# Altium project SingleBoardDrone.PrjPcb (part 2 of 2)

## Sheet SingleBoardDrone_Sens.SchDoc
size B; SheetNumber: 4; SheetTotal: 5
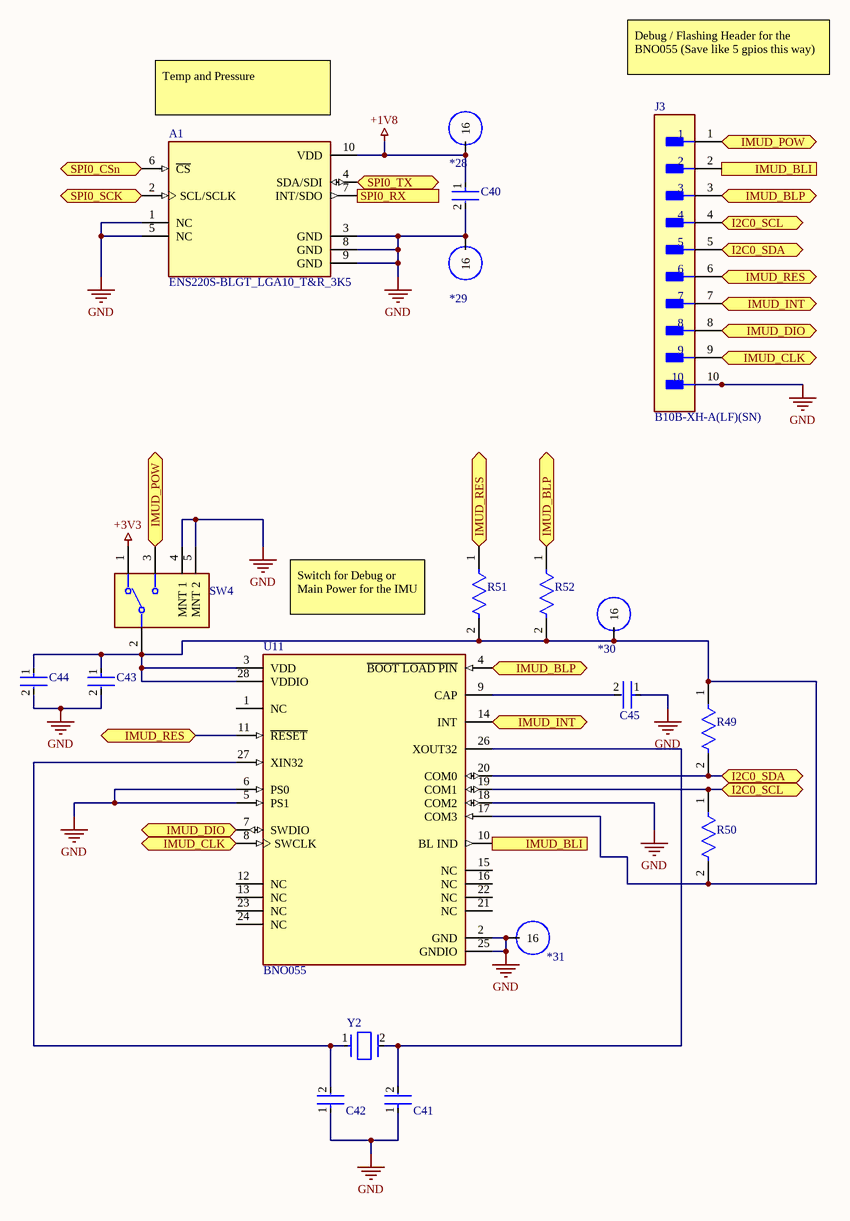
[diagram p3: SingleBoardDrone_Sens.SchDoc]

### Parts
*28  Component_1  [Test_Point]  (value not drawn)  (no BOM)
*29  Component_1  [Test_Point]  (value not drawn)  (no BOM)
*30  Component_1  [Test_Point]  (value not drawn)  (no BOM)
*31  Component_1  [Test_Point]  (value not drawn)  (no BOM)
A1  ENS220S-BLGT_LGA10_T&R_3K5  [XDCR_ENS220S-BLGT_LGA10_T&R_3K5]
C40  CL03A104KP3NNNC  [FP-CL03-IPC_C]  (value not drawn)
C41  C0805C220J5RACTU  [FP-C0805C-DN-MFG]  (value not drawn)
C42  C0805C220J5RACTU  [FP-C0805C-DN-MFG]  (value not drawn)
C43  CL03A104KP3NNNC  [FP-CL03-IPC_C]  (value not drawn)
C44  CL03A104KP3NNNC  [FP-CL03-IPC_C]  (value not drawn)
C45  CGA3E1X7R1E105K080AC  [FP-CGA3E-0_3-0_1-IPC_A]  (value not drawn)
J3  B10B-XH-A(LF)(SN)  [FP-B10B-XH-A_LF_SN-MFG]
R49  RMCF0603JG10K0  [FP-RMCF0603-MFG]  (value not drawn)
R50  RMCF0603JG10K0  [FP-RMCF0603-MFG]  (value not drawn)
R51  RMCF0603JG10K0  [FP-RMCF0603-MFG]  (value not drawn)
R52  RMCF0603JG10K0  [FP-RMCF0603-MFG]  (value not drawn)
SW4  1825232-1  [FP-1825232-1-MFG]  (value not drawn)
U11  BNO055  [FP-BNO055-MFG]
Y2  ABS07-32.768KHZ-T  [FP-ABS07-MFG]  (value not drawn)

### Ports
I2C0_SCL (bidir, see SingleBoardDrone_RP2350[3B], SingleBoardDrone_Sens[3A]), I2C0_SCL (bidir, see SingleBoardDrone_RP2350[3B], SingleBoardDrone_Sens[3C]), I2C0_SDA (bidir, see SingleBoardDrone_RP2350[3B], SingleBoardDrone_Sens[3A]), I2C0_SDA (bidir, see SingleBoardDrone_RP2350[3B], SingleBoardDrone_Sens[3C]), IMUD_BLI (out, see SingleBoardDrone_Sens[2C]), IMUD_BLI (out, see SingleBoardDrone_Sens[3A]), IMUD_BLP (bidir, see SingleBoardDrone_Sens[2B], SingleBoardDrone_Sens[2C]), IMUD_BLP (bidir, see SingleBoardDrone_Sens[2B], SingleBoardDrone_Sens[3A]), IMUD_BLP (bidir, see SingleBoardDrone_Sens[2C], SingleBoardDrone_Sens[3A]), IMUD_CLK (bidir, see SingleBoardDrone_Sens[1C]), IMUD_CLK (bidir, see SingleBoardDrone_Sens[3B]), IMUD_DIO (bidir, see SingleBoardDrone_Sens[1C]), IMUD_DIO (bidir, see SingleBoardDrone_Sens[3B]), IMUD_INT (bidir, see SingleBoardDrone_RP2350[1A], SingleBoardDrone_Sens[2C]), IMUD_INT (bidir, see SingleBoardDrone_RP2350[1A], SingleBoardDrone_Sens[3B]), IMUD_POW (bidir, see SingleBoardDrone_Sens[1B]), IMUD_POW (bidir, see SingleBoardDrone_Sens[3A]), IMUD_RES (bidir, see SingleBoardDrone_Sens[1C], SingleBoardDrone_Sens[2B]), IMUD_RES (bidir, see SingleBoardDrone_Sens[1C], SingleBoardDrone_Sens[3B]), IMUD_RES (bidir, see SingleBoardDrone_Sens[2B], SingleBoardDrone_Sens[3B]), SPI0_CSn (bidir, see SingleBoardDrone_RP2350[1A]), SPI0_RX (out, see SingleBoardDrone_RP2350[1A]), SPI0_SCK (bidir, see SingleBoardDrone_RP2350[1A]), SPI0_TX (bidir, see SingleBoardDrone_RP2350[1A])

### Nets
+1V8: *28.TP1(16) A1.10(VDD) C40.1
+3V3: SW4.1
GND: *29.TP1(16) *31.TP1(16) A1.1(NC) A1.3(GND) A1.5(NC) A1.8(GND) A1.9(GND) C40.2 C41.1 C42.1 C43.2 C44.2 C45.1 J3.10 SW4.4(MNT_1) SW4.5(MNT_2) U11.2(GND) U11.5(PS1) U11.6(PS0) U11.18(COM2) U11.25(GNDIO)
Net*30_TP1: *30.TP1(16) C43.1 C44.1 R49.1 R50.2 R51.2 R52.2 SW4.2 U11.3(VDD) U11.17(COM3) U11.28(VDDIO)
NetA1_2: A1.2(SCL/SCLK) ; port SPI0_SCK
NetA1_4: A1.4(SDA/SDI) ; port SPI0_TX
NetA1_6: A1.6(~{CS}) ; port SPI0_CSn
NetA1_7: A1.7(INT/SDO) ; port SPI0_RX
NetC41_2: C41.2 U11.26(XOUT32) Y2.2
NetC42_2: C42.2 U11.27(XIN32) Y2.1
NetC45_2: C45.2 U11.9(CAP)
NetJ3_1: J3.1 SW4.3 ; port IMUD_POW
NetJ3_2: J3.2 U11.10(BL_IND) ; port IMUD_BLI
NetJ3_3: J3.3 R52.1 U11.4(~{BOOT_LOAD_PIN}) ; port IMUD_BLP
NetJ3_4: J3.4 R50.1 U11.19(COM1) ; port I2C0_SCL
NetJ3_5: J3.5 R49.2 U11.20(COM0) ; port I2C0_SDA
NetJ3_6: J3.6 R51.1 U11.11(~{RESET}) ; port IMUD_RES
NetJ3_7: J3.7 U11.14(INT) ; port IMUD_INT
NetJ3_8: J3.8 U11.7(SWDIO) ; port IMUD_DIO
NetJ3_9: J3.9 U11.8(SWCLK) ; port IMUD_CLK

Not connected (* = marked no-connect by the designer): U11 1(NC) 12(NC) 13(NC) 15(NC) 16(NC) 21(NC) 22(NC) 23(NC) 24(NC)

### Notes on the sheet
- (near A1) Temp and Pressure
- Debug / Flashing Header for the BNO055 (Save like 5 gpios this way)
- Switch for Debug or Main Power for the IMU

### Library data of the parts
A1 = ENS220S-BLGT_LGA10_T&R_3K5: Premium accuracy barometric pressure and temperature sensor for activity tracking and indoor navigation/localization; MF: ScioSense; MP: ENS220S-BLGT LGA10 T&amp;R 3K5; SnapEDA_Link: https://www.snapeda.com/parts/ENS220S-BLGT%20LGA10%20T&R%203K5/ScioSense/view-part/?ref=snap; Package: None; Value: *; Check_prices: https://www.snapeda.com/parts/ENS220S-BLGT%20LGA10%20T&R%203K5/ScioSense/view-part/?ref=eda
C40 C43 C44 = CMP-2010-00672-2: as C3 on sheet SingleBoardDrone_RP2350; Radiation Hardening: No; Voltage Rating: 10V; Dielectric: X5R; Length: 0.6mm; Voltage Rating (DC): 10V; Package Quantity: 1; Height: 0.3mm; Width: 0.012inch; Min Operating Temperature: -55°C; Lead Free: Lead Free; Tolerance: 10%; Contact Plating: Tin; Depth: 0.3mm; Max Operating Temperature: 85°C; Case/Package: 0201; Capacitance: 100nF; Mount: Surface Mount; Thickness: 0.013inch; Case Code (Metric): 0603; Case Code (Imperial): 0201; Packaging: Tape and Reel
C41 C42 = CMP-03020-030005-1: C0805 22 pF X7R 30ppm/°C 5.00% 50 V; Manufacturer: KEMET; Voltage Rating: 50 V; Value: 22 pF; Material: Ceramic; Tolerance: 0.05; RoHS: TRUE; Temperature Range Low: -55°C; Temperature: -55°C to +125°C; Device Class L3: Ceramic Capacitors; Temperature Coefficient: 30ppm/°C; Temperature Range High: +125°C; Octopart: https://octopart.com/c0805c220j5ractu-kemet-76790706; Automotive: No; Manufacturer Part Number: C0805C220J5RACTU; ComponentLink2Description: Datasheet; Ipc Land Pattern Name: CAPC200125X78; Temperature Characteristic: X7R; Category: Cap; Package: C0805C-DN; Lead Free: Yes; Capacitance: 22 pF; Device Class L2: Capacitors; ComponentLink2URL: https://content.kemet.com/datasheets/KEM_C1003_C0G_SMD.pdf; Height: 0.88mm; Device Class L1: Passive Components
C45 = CMP-08246-001507-1: as C37 on sheet SingleBoardDrone_Pow; Dielectric: X7R; Capacitance: 1uF; Voltage Rating: 25V; Thickness: 0.035inch; Width: 0.031inch; Ratings: AEC-Q200; Case Code (Metric): 1608; REACH SVHC: No SVHC; Voltage: 25V; Composition: Ceramic; Min Operating Temperature: -55°C; Termination: SMD/SMT; Depth: 0.8mm; Max Operating Temperature: 125°C; Mount: Surface Mount; Weight: 7.1E-05oz; Package Quantity: 4000; Tolerance: 10%; Packaging: Tape and Reel; Lead Free: Lead Free; Case/Package: 0603; Length: 1.6mm; Height: 0.8mm; Case Code (Imperial): 0603; Voltage Rating (DC): 25V
J3 = CMP-17439-000145-1: CONN HEADER VERT 10POS 2.5MM; Voltage Rating: 250V; Current Rating: 3A; Wire/Cable Gauge: 22AWG; Number of Contacts: 10; Contact Resistance: 20mR; Mated Stacking Heights: 9.8mm; Gender: Male; Insulation Resistance: 1GR; Series: XH; Max Current Rating: 3A; Contact Shape: Square; Contact Material: Brass; Housing Material: Polyamide; Lead Free: Lead Free; Orientation: Straight; Max Voltage Rating (DC): 250V; Contact Type: Male Pin; Number of Positions: 10; Length: 27.4mm; Housing Color: White; Max Voltage Rating (AC): 250V; Depth: 5.75mm; Mount: Through Hole; Pitch: 2.5mm; Fastening Type: Detent; Flammability Rating: UL94 V-0; Color: Natural; Contact Plating: Tin; Insulation Color: Natural; Packaging: Bulk; REACH SVHC: No SVHC; Insulation Material: Nylon; Connector Type: Header; Lead Pitch: 2.5mm; Contact Finish - Mating: TIN; Voltage Rating (AC): 250V; Number of Rows: 1; Max Operating Temperature: 85°C; Min Operating Temperature: -25°C; Termination: Solder
R49-R52 = CMP-26527-000153-1: as R90 on sheet SingleBoardDrone_Pow; Tolerance: 5%; Case Code (Imperial): 0603; Series: RMCF; Resistor Type: Thick Film; Length: 0.061inch; Features: Automotive AEC-Q200; Height: 0.022inch; Case Code (Metric): 1608; Width: 0.031inch; Number of Terminations: 2; Contact Plating: Tin; Case/Package: 0603; Package Quantity: 1; Max Operating Temperature: 155°C; Mount: Surface Mount; RoHS Compliant: Yes; Radiation Hardening: No; Min Operating Temperature: -55°C; Packaging: Tape and Reel
SW4 = CMP-03405-000001-1: SWITCH SLIDE SPDT 200MA 30V; Manufacturer: TE Connectivity; Contact Current Rating: 0.2A; Contact Resistance: 20mΩ; Electromechanical Life: 10000Cycles; Operating Force: 200gf; Throw Configuration: SPDT; Manufacturer Part Number: 1825232-1; Temperature Range High: +70°C; Height: 3.7mm; ComponentLink2URL: https://www.te.com/commerce/DocumentDelivery/DDEController?Action=showdoc&DocId=Customer+Drawing%7F1825232%7FB2%7Fpdf%7FEnglish%7FENG_CD_1825232_B2.pdf%7F1825232-1; Mount: Through Hole; Mouser Description: Slide Switches SLIDE SWITCH SPDT Right Angle; Package: 1825232-1; Temperature: -20°C to +70°C; Automotive: No; ComponentLink2Description: Datasheet; Lead Free: Yes; Octopart: https://octopart.com/1825232-1-te+connectivity-45209882; Device Class L1: Electromechanical; Digikey Description: SWITCH SLIDE SPDT 200MA 30V; Device Class L3: Slide Switches; Device Class L2: Switches; Voltage Rating Dc: 30V; Temperature Range Low: -20°C; Category: Switch; RoHS: TRUE
U11 = CMP-2000-05075-4: IMU ACCEL/GYRO/MAG I2C 28LGA; Sensor Type: Accelerometer; Packaging: Tape and Reel; Case/Package: LGA; Min Operating Temperature: -40°C; Mount: Surface Mount; Output Type: I2C; Lead Free: Lead Free; Max Operating Temperature: 85°C
Y2 = CMP-0447-00001-4: Crystal 32.768kHz ±20ppm (Tol) 12.5pF FUND 70kΩ 2-Pin CSMD T/R; ESR (Equivalent Series Resistance): 70kR; Radiation Hardening: No; Frequency: 32.768kHz; Length: 3.2mm; Max Operating Temperature: 85°C; Number of Pins: 2; Series: ABS07; Min Operating Temperature: -40°C; Frequency Tolerance: 20ppm; Packaging: Tape and Reel; Height: 0.9mm; Width: 1.5mm; Depth: 1.5mm; Load Capacitance: 12.5pF; RoHS Compliant: Yes; Tolerance: 20ppm; Termination: SMD/SMT; Lead Free: Lead Free; Series Resistance: 70kR; REACH SVHC: No SVHC; Case/Package: CSMD; Operating Frequency: 32.768 kHz; Package Quantity: 3000

## Sheet SingleBoardDrone_RF.SchDoc
size B; SheetNumber: 5; SheetTotal: 5
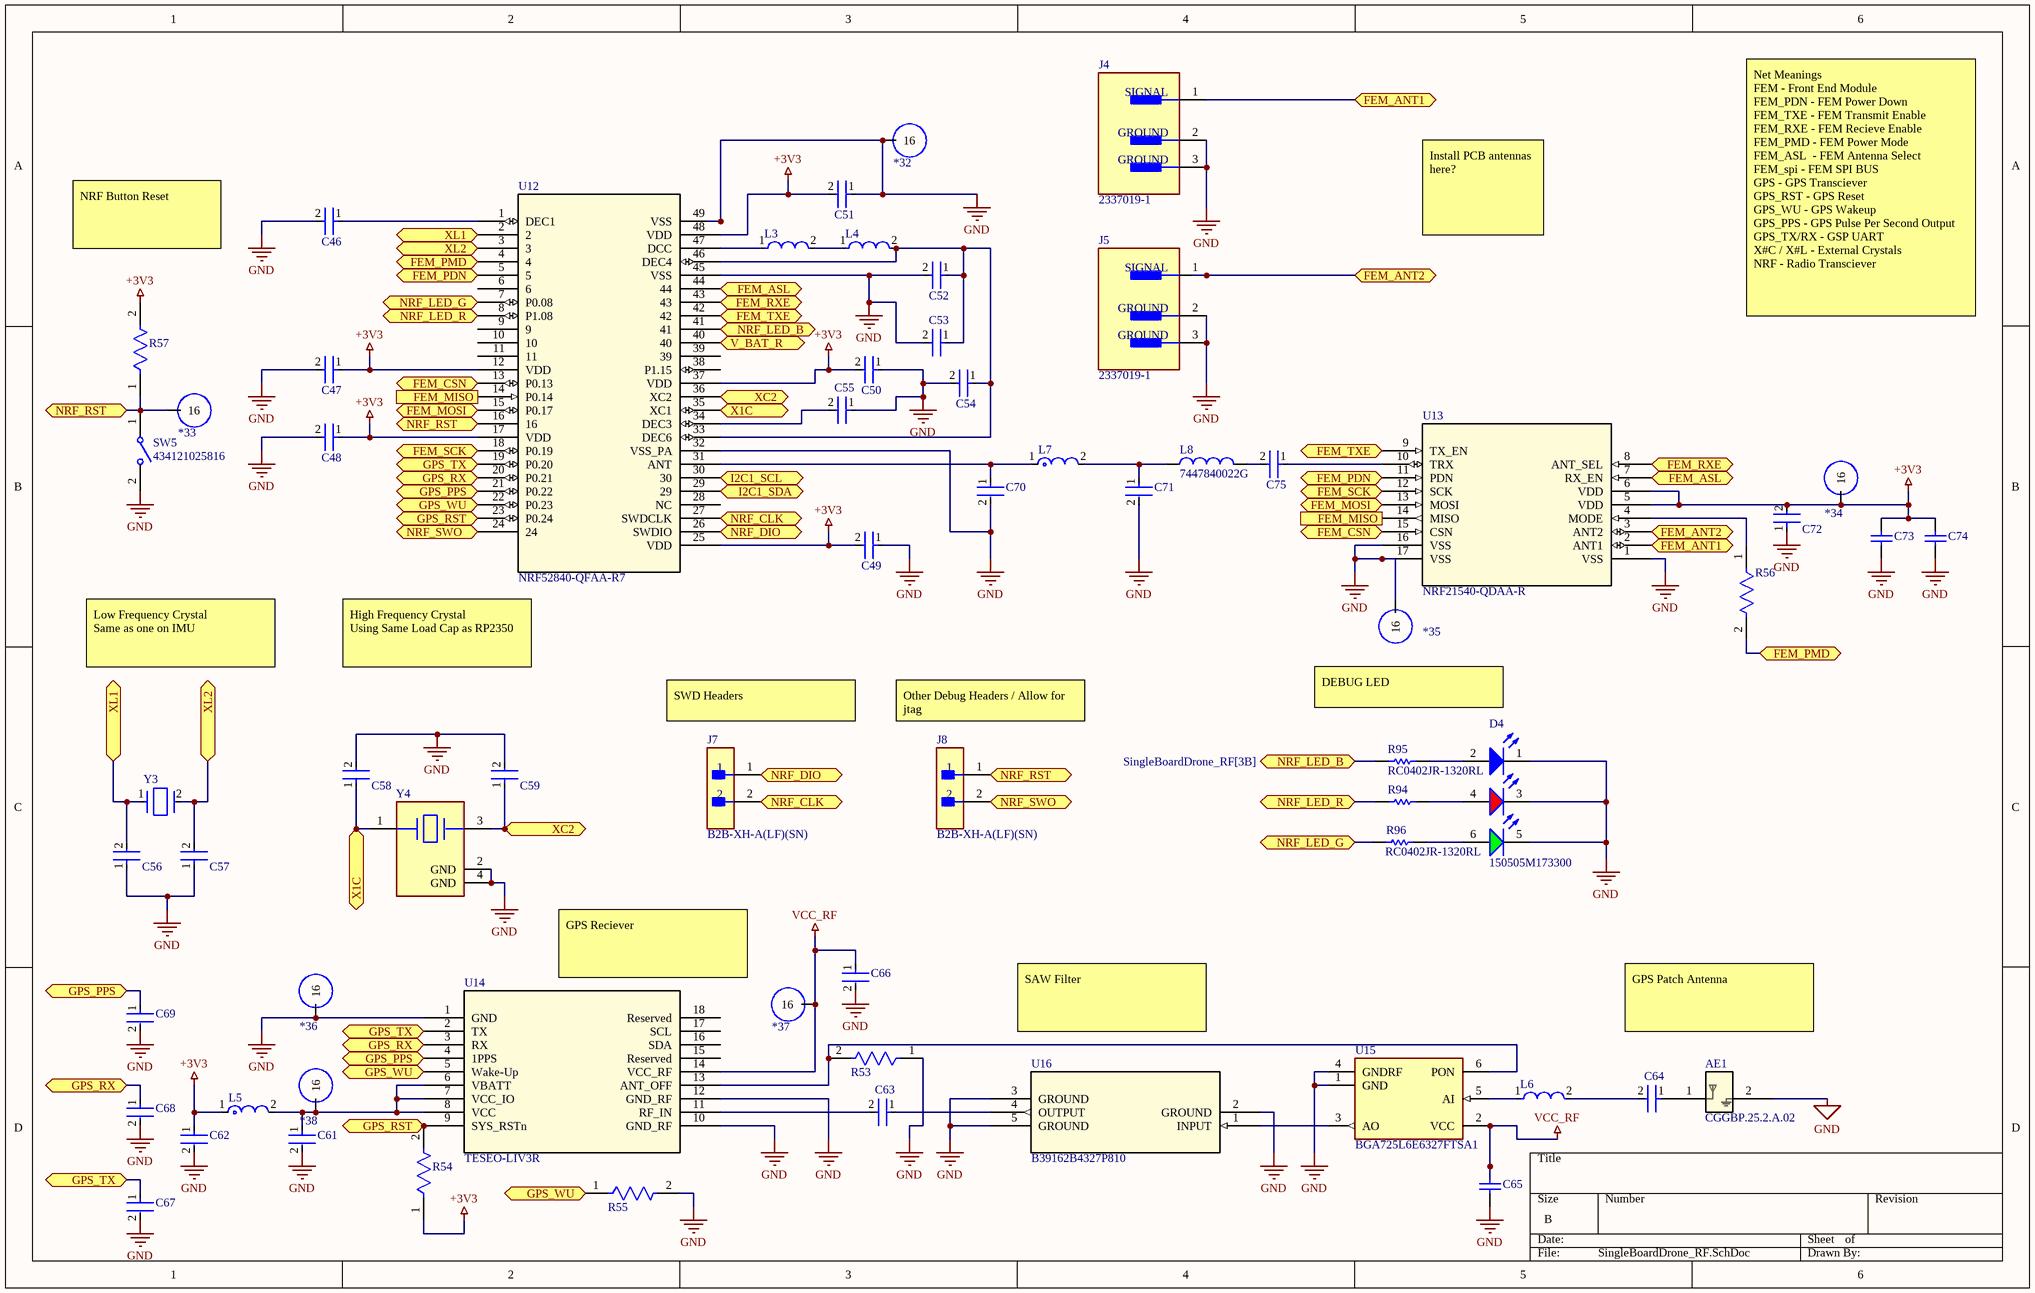
[diagram p4: SingleBoardDrone_RF.SchDoc]

### Parts
*32  Component_1  [Test_Point]  (value not drawn)  (no BOM)
*33  Component_1  [Test_Point]  (value not drawn)  (no BOM)
*34  Component_1  [Test_Point]  (value not drawn)  (no BOM)
*35  Component_1  [Test_Point]  (value not drawn)  (no BOM)
*36  Component_1  [Test_Point]  (value not drawn)  (no BOM)
*37  Component_1  [Test_Point]  (value not drawn)  (no BOM)
*38  Component_1  [Test_Point]  (value not drawn)  (no BOM)
AE1  CGGBP.25.2.A.02  [ANT_CGGBP.25.2.A.02_TAL]
C46  CL03A104KP3NNNC  [FP-CL03-IPC_C]  (value not drawn)
C47  CL03A104KP3NNNC  [FP-CL03-IPC_C]  (value not drawn)
C48  CL03A104KP3NNNC  [FP-CL03-IPC_C]  (value not drawn)
C49  CL03A104KP3NNNC  [FP-CL03-IPC_C]  (value not drawn)
C50  CL03A104KP3NNNC  [FP-CL03-IPC_C]  (value not drawn)
C51  CGA3E1X7R1E105K080AC  [FP-CGA3E-0_3-0_1-IPC_A]  (value not drawn)
C52  CGA3E1X7R1E105K080AC  [FP-CGA3E-0_3-0_1-IPC_A]  (value not drawn)
C53  EMK105B7473KV-F  [FP-0402-L_1_0_0_05-W_0_5-MFG]  (value not drawn)
C54  CL03A104KP3NNNC  [FP-CL03-IPC_C]  (value not drawn)
C55  GRM033R61E101KA01D  [FP-GRM033-0_03-IPC_C]  (value not drawn)
C56  C0805C220J5RACTU  [FP-C0805C-DN-MFG]  (value not drawn)
C57  C0805C220J5RACTU  [FP-C0805C-DN-MFG]  (value not drawn)
C58  CC0402JRNPO9BN150  [FP-CC0402-0_55-IPC_B]  (value not drawn)
C59  CC0402JRNPO9BN150  [FP-CC0402-0_55-IPC_B]  (value not drawn)
C61  GRM0335C1H560JA01D  [FP-GRM033-0_03-IPC_B]  (value not drawn)
C62  GRM033R61E103KA12D  [FP-GRM033-0_03-IPC_C]  (value not drawn)
C63  GCM1555C1H121JA16D  [FP-GCM155-0_05-IPC_A]  (value not drawn)
C64  GCM1555C1H121JA16D  [FP-GCM155-0_05-IPC_A]  (value not drawn)
C65  GCM155R71H102KA37D  [CAPC1005X55X25LL05T10]  (value not drawn)
C66  GRM0335C1H560JA01D  [FP-GRM033-0_03-IPC_B]  (value not drawn)
C67  GRM0335C1H560JA01D  [FP-GRM033-0_03-IPC_B]  (value not drawn)
C68  GRM0335C1H560JA01D  [FP-GRM033-0_03-IPC_B]  (value not drawn)
C69  GRM0335C1H560JA01D  [FP-GRM033-0_03-IPC_B]  (value not drawn)
C70  GJM1555C1H1R0WB01D  [FP-GJM155-0_05-IPC_B]  (value not drawn)
C71  GJM0335C1E1R2BB01D  [FP-GJM033-0_03-MFG]  (value not drawn)
C72  CL03A104KP3NNNC  [FP-CL03-IPC_C]  (value not drawn)
C73  CL10A475KQ8NNNC  [CAPC1608X90X30LL10T20]  (value not drawn)
C74  CL10A475KQ8NNNC  [CAPC1608X90X30LL10T20]  (value not drawn)
C75  GJM1555C1H1R0WB01D  [FP-GJM155-0_05-IPC_B]  (value not drawn)
D4  150505M173300  [WL-SFTW_5050_150505M173300]
J4  2337019-1  [FP-2337019-1-MFG]
J5  2337019-1  [FP-2337019-1-MFG]
J7  B2B-XH-A(LF)(SN)  [FP-B2B-XH-A_LF_SN-MFG]
J8  B2B-XH-A(LF)(SN)  [FP-B2B-XH-A_LF_SN-MFG]
L3  LB2012T100K  [FP-LB2012-1_25-0_2-MFG]  (value not drawn)
L4  CB2518T150K  [FP-CB2518-IPC_B]  (value not drawn)
L5  LQG15HS27NJ02D  [FP-LQG15HH_02-IPC_C]  (value not drawn)
L6  LQW15AN5N6G80D  [FP-LQW15AN_80-MFG]  (value not drawn)
L7  LQG15HS4N7S02D  [FP-LQG15HH_02-IPC_A]  (value not drawn)
L8  7447840022G  [WE-MK_0402_L1W0.5H0.5]
R53  RMCF0603JG10K0  [FP-RMCF0603-MFG]  (value not drawn)
R54  RMCF0603JG10K0  [FP-RMCF0603-MFG]  (value not drawn)
R55  RMCF0603JG10K0  [FP-RMCF0603-MFG]  (value not drawn)
R56  AF0402FR-0733KL  [FP-AF0402-IPC_A]  (value not drawn)
R57  RMCF0603JG10K0  [FP-RMCF0603-MFG]  (value not drawn)
R94  ERJ-3EKF1400V  [RESC1608X55X30NL15T15]  (value not drawn)
R95  RC0402JR-1320RL  [RESC1005X40X25NL05T10]
R96  RC0402JR-1320RL  [RESC1005X40X25NL05T10]
SW5  434121025816  [434121025816]
U12  NRF52840-QFAA-R7  [QFN48_NRF52840-QFAA-R7_NOR]
U13  NRF21540-QDAA-R  [QFN16_4X4_NOR]
U14  TESEO-LIV3R  [ARRAY_LIV3R_STM]
U15  BGA725L6E6327FTSA1  [FP-PG-TSLP-6-MFG]
U16  B39162B4327P810  [B39162B4327P810_TDK]
Y3  ABS07-32.768KHZ-T  [FP-ABS07-MFG]  (value not drawn)
Y4  ABM8-32.000MHZ-10-D1G-T  [FP-ABM8-MFG]  (value not drawn)

### Ports
FEM_ANT1 (bidir, see SingleBoardDrone_RF[5A]), FEM_ANT1 (bidir, see SingleBoardDrone_RF[5B]), FEM_ANT2 (bidir, see SingleBoardDrone_RF[5A]), FEM_ANT2 (bidir, see SingleBoardDrone_RF[5B]), FEM_ASL (bidir, see SingleBoardDrone_RF[3A]), FEM_ASL (bidir, see SingleBoardDrone_RF[5B]), FEM_CSN (bidir, see SingleBoardDrone_RF[2B]), FEM_CSN (bidir, see SingleBoardDrone_RF[4B]), FEM_MISO (out, see SingleBoardDrone_RF[2B]), FEM_MISO (out, see SingleBoardDrone_RF[4B]), FEM_MOSI (bidir, see SingleBoardDrone_RF[2B]), FEM_MOSI (bidir, see SingleBoardDrone_RF[4B]), FEM_PDN (bidir, see SingleBoardDrone_RF[2A]), FEM_PDN (bidir, see SingleBoardDrone_RF[4B]), FEM_PMD (bidir, see SingleBoardDrone_RF[2A]), FEM_PMD (bidir, see SingleBoardDrone_RF[6C]), FEM_RXE (bidir, see SingleBoardDrone_RF[3A]), FEM_RXE (bidir, see SingleBoardDrone_RF[5B]), FEM_SCK (bidir, see SingleBoardDrone_RF[2B]), FEM_SCK (bidir, see SingleBoardDrone_RF[4B]), FEM_TXE (bidir, see SingleBoardDrone_RF[3A]), FEM_TXE (bidir, see SingleBoardDrone_RF[4B]), GPS_PPS (bidir, see SingleBoardDrone_RF[1D], SingleBoardDrone_RF[2B]), GPS_PPS (bidir, see SingleBoardDrone_RF[1D], SingleBoardDrone_RF[2D]), GPS_PPS (bidir, see SingleBoardDrone_RF[2B], SingleBoardDrone_RF[2D]), GPS_RST (bidir, see SingleBoardDrone_RF[2B]), GPS_RST (bidir, see SingleBoardDrone_RF[2D]), GPS_RX (bidir, see SingleBoardDrone_RF[1D], SingleBoardDrone_RF[2B]), GPS_RX (bidir, see SingleBoardDrone_RF[1D], SingleBoardDrone_RF[2D]), GPS_RX (bidir, see SingleBoardDrone_RF[2B], SingleBoardDrone_RF[2D]), GPS_TX (bidir, see SingleBoardDrone_RF[1D], SingleBoardDrone_RF[2B]), GPS_TX (bidir, see SingleBoardDrone_RF[1D], SingleBoardDrone_RF[2D]), GPS_TX (bidir, see SingleBoardDrone_RF[2B], SingleBoardDrone_RF[2D]), GPS_WU (bidir, see SingleBoardDrone_RF[2B], SingleBoardDrone_RF[2D]), GPS_WU (bidir, see SingleBoardDrone_RF[2D]), I2C1_SCL (bidir, see SingleBoardDrone_RP2350[1B]), I2C1_SDA (bidir, see SingleBoardDrone_RP2350[1B]), NRF_CLK (bidir, see SingleBoardDrone_RF[3B]), NRF_CLK (bidir, see SingleBoardDrone_RF[3C]), NRF_DIO (bidir, see SingleBoardDrone_RF[3B]), NRF_DIO (bidir, see SingleBoardDrone_RF[3C]), NRF_LED_B (bidir, see SingleBoardDrone_RF[3B]), NRF_LED_B (bidir, see SingleBoardDrone_RF[4C]), NRF_LED_G (bidir, see SingleBoardDrone_RF[2A]), NRF_LED_G (bidir, see SingleBoardDrone_RF[4C]), NRF_LED_R (bidir, see SingleBoardDrone_RF[2A]), NRF_LED_R (bidir, see SingleBoardDrone_RF[4C]), NRF_RST (bidir, see SingleBoardDrone_RF[1B], SingleBoardDrone_RF[2B]), NRF_RST (bidir, see SingleBoardDrone_RF[1B], SingleBoardDrone_RF[3C]), NRF_RST (bidir, see SingleBoardDrone_RF[2B], SingleBoardDrone_RF[3C]), NRF_SWO (bidir, see SingleBoardDrone_RF[2B]), NRF_SWO (bidir, see SingleBoardDrone_RF[3C]), V_BAT_R (bidir, see SingleBoardDrone_Pow[2A]), X1C (bidir, see SingleBoardDrone_RF[2C]), X1C (bidir, see SingleBoardDrone_RF[3B]), XC2 (bidir, see SingleBoardDrone_RF[2C]), XC2 (bidir, see SingleBoardDrone_RF[3B]), XL1 (bidir, see SingleBoardDrone_RF[1C]), XL1 (bidir, see SingleBoardDrone_RF[2A]), XL2 (bidir, see SingleBoardDrone_RF[1C]), XL2 (bidir, see SingleBoardDrone_RF[2A])

### Nets
+3V3: *34.TP1(16) C47.1 C48.1 C49.2 C50.2 C51.2 C62.1 C72.2 C73.1 C74.1 L5.1 R54.1 R57.2 U12.12(VDD) U12.17(VDD) U12.25(VDD) U12.37(VDD) U12.48(VDD) U13.5(VDD) U13.6(VDD)
GND: *32.TP1(16) *35.TP1(16) *36.TP1(16) AE1.2 C46.2 C47.2 C48.2 C49.1 C50.1 C51.1 C52.2 C53.2 C54.2 C55.1 C56.1 C57.1 C58.2 C59.2 C61.2 C62.2 C65.2 C66.2 C67.2 C68.2 C69.2 C70.2 C71.2 C72.1 C73.2 C74.2 D4.1(K) D4.3(K) D4.5(K) J4.2(GROUND) J4.3(GROUND) J5.2(GROUND) J5.3(GROUND) R53.1 R55.2 SW5.2 U12.32(VSS_PA) U12.45(VSS) U12.49(VSS) U13.1(VSS) U13.16(VSS) U13.17(VSS) U14.1(GND) U14.10(GND_RF) U14.12(GND_RF) U15.1(GND) U15.4(GNDRF) U16.2(GROUND) U16.3(GROUND) U16.5(GROUND) Y4.2(GND) Y4.4(GND)
VCC_RF: *37.TP1(16) C65.1 C66.1 U14.14(VCC_RF) U15.2(VCC)
Net*33_TP1: *33.TP1(16) J8.1 R57.1 SW5.1 U12.16 ; port NRF_RST
Net*38_TP1: *38.TP1(16) C61.1 L5.2 U14.6(VBATT) U14.7(VCC_IO) U14.8(VCC)
NetAE1_1: AE1.1 C64.1
NetC46_1: C46.1 U12.1(DEC1)
NetC52_1: C52.1 C53.1 C54.1 L4.2 U12.33(DEC6) U12.46(DEC4)
NetC55_2: C55.2 U12.34(DEC3)
NetC56_2: C56.2 U12.2 Y3.1 ; port XL1
NetC57_2: C57.2 U12.3 Y3.2 ; port XL2
NetC58_1: C58.1 U12.35(XC1) Y4.1 ; port X1C
NetC59_1: C59.1 U12.36(XC2) Y4.3 ; port XC2
NetC63_1: C63.1 U16.4(OUTPUT)
NetC63_2: C63.2 U14.11(RF_IN)
NetC64_2: C64.2 L6.2
NetC67_1: C67.1 U12.19(P0.20) U14.2(TX) ; port GPS_TX
NetC68_1: C68.1 U12.20(P0.21) U14.3(RX) ; port GPS_RX
NetC69_1: C69.1 U12.21(P0.22) U14.4(1PPS) ; port GPS_PPS
NetC70_1: C70.1 L7.1 U12.31(ANT)
NetC71_1: C71.1 L7.2 L8.1
NetC75_1: C75.1 U13.10(TRX)
NetC75_2: C75.2 L8.2
NetD4_2: D4.2(A) R95.2
NetD4_4: D4.4(A) R94.2
NetD4_6: D4.6(A) R96.2
NetJ4_1: J4.1(SIGNAL) U13.2(ANT1) ; port FEM_ANT1
NetJ5_1: J5.1(SIGNAL) U13.3(ANT2) ; port FEM_ANT2
NetJ7_1: J7.1 U12.26(SWDIO) ; port NRF_DIO
NetJ7_2: J7.2 U12.27(SWDCLK) ; port NRF_CLK
NetJ8_2: J8.2 U12.24 ; port NRF_SWO
NetL3_1: L3.1 U12.47(DCC)
NetL3_2: L3.2 L4.1
NetL6_1: L6.1 U15.5(AI)
NetR53_2: R53.2 U14.13(ANT_OFF) U15.6(PON)
NetR54_2: R54.2 U12.23(P0.24) U14.9(SYS_RSTn) ; port GPS_RST
NetR55_1: R55.1 U12.22(P0.23) U14.5(Wake-Up) ; port GPS_WU
NetR56_1: R56.1 U13.4(MODE)
NetR56_2: R56.2 U12.4 ; port FEM_PMD
NetR94_1: R94.1 U12.8(P1.08) ; port NRF_LED_R
NetR95_1: R95.1 U12.41 ; port NRF_LED_B
NetR96_1: R96.1 U12.7(P0.08) ; port NRF_LED_G
NetR98_1: U12.40 ; port V_BAT_R
NetU1_14: U12.29 ; port I2C1_SDA
NetU1_15: U12.30 ; port I2C1_SCL
NetU12_5: U12.5 U13.11(PDN) ; port FEM_PDN
NetU12_13: U12.13(P0.13) U13.15(CSN) ; port FEM_CSN
NetU12_14: U12.14(P0.14) U13.14(MISO) ; port FEM_MISO
NetU12_15: U12.15(P0.17) U13.13(MOSI) ; port FEM_MOSI
NetU12_18: U12.18(P0.19) U13.12(SCK) ; port FEM_SCK
NetU12_42: U12.42 U13.9(TX_EN) ; port FEM_TXE
NetU12_43: U12.43 U13.8(ANT_SEL) ; port FEM_RXE
NetU12_44: U12.44 U13.7(RX_EN) ; port FEM_ASL
NetU15_3: U15.3(AO) U16.1(INPUT)

Not connected (* = marked no-connect by the designer): U12 6 9 10 11 28(NC) 38(P1.15) 39; U14 15(Reserved) 16(SDA) 17(SCL) 18(Reserved)

### Notes on the sheet
- Install PCB antennas here?
- NRF Button Reset
- Net Meanings
  FEM - Front End Module
  FEM_PDN - FEM Power Down
  FEM_TXE - FEM Transmit Enable
  FEM_RXE - FEM Recieve Enable
  FEM_PMD - FEM Power Mode
  FEM_ASL  - FEM Antenna Select
  FEM_spi - FEM SPI BUS
  GPS - GPS Transciever
  GPS_RST - GPS Reset
  GPS_WU - GPS Wakeup
  GPS_PPS - GPS Pulse Per Second Output
  GPS_TX/RX - GSP UART
  X#C / X#L - External Crystals
  NRF - Radio Transciever
- Low Frequency Crystal
  Same as one on IMU
- High Frequency Crystal
  Using Same Load Cap as RP2350
- DEBUG LED
- SWD Headers
- Other Debug Headers / Allow for jtag
- GPS Reciever
- SAW Filter
- (near U15) GPS LNA
- GPS Patch Antenna

### Library data of the parts
AE1 = CGGBP.25.2.A.02: No Description Available; Manufacturer_Name: Taoglas Limited; Type: RF; Copyright: Copyright (C) 2025 Ultra Librarian. All rights reserved.; Manufacturer_Part_Number: CGGBP.25.2.A.02; RefDes: RefDes
C46-C50 C54 C72 = CMP-2010-00672-2: Cap Ceramic 100nF 10V X5R ±10% Pad SMD 0201 +85°C T/R; Radiation Hardening: No; Voltage Rating: 10V; Dielectric: X5R; Length: 0.6mm; Voltage Rating (DC): 10V; Package Quantity: 1; Height: 0.3mm; Width: 0.012inch; Min Operating Temperature: -55°C; Lead Free: Lead Free; Tolerance: 10%; Contact Plating: Tin; Depth: 0.3mm; Max Operating Temperature: 85°C; Case/Package: 0201; Capacitance: 100nF; Mount: Surface Mount; Thickness: 0.013inch; Case Code (Metric): 0603; Case Code (Imperial): 0201; Packaging: Tape and Reel
C51 C52 = CMP-08246-001507-1: Cap Ceramic 1uF 25V X7R 10% Pad SMD 0603 +125°C Automotive T/R; Dielectric: X7R; Capacitance: 1uF; Voltage Rating: 25V; Thickness: 0.035inch; Width: 0.031inch; Ratings: AEC-Q200; Case Code (Metric): 1608; REACH SVHC: No SVHC; Voltage: 25V; Composition: Ceramic; Min Operating Temperature: -55°C; Termination: SMD/SMT; Depth: 0.8mm; Max Operating Temperature: 125°C; Mount: Surface Mount; Weight: 7.1E-05oz; Package Quantity: 4000; Tolerance: 10%; Packaging: Tape and Reel; Lead Free: Lead Free; Case/Package: 0603; Length: 1.6mm; Height: 0.8mm; Case Code (Imperial): 0603; Voltage Rating (DC): 25V
C53 = CMP-14477-000851-3: Ceramic Capacitor General Use 0.047uF ±10% 16V X7R 0402; NexarPartId: 7073257; Capacitance: 47nF; Width: 500µm; Max Width: 550µm; Voltage Rating: 16V; Packaging: Cut Tape (CT); Material: Ceramic; Max Operating Temperature: 125°C; Length: 1mm; Height: 550µm; Number of Pins: 2; Radiation Hardening: No; Dielectric: X7R; RoHS: Compliant; Case Code (Metric): 1005; Min Length: 950µm; Min Thickness: 450µm; Min Operating Temperature: -55°C; Voltage: 16V; Composition: Ceramic; Max Length: 1.05mm; Depth: 500µm; Mount: Surface Mount; Max Thickness: 550µm; Min Width: 450µm; Voltage Rating (DC): 16V; Tolerance: 10%; Case Code (Imperial): 0402; REACH SVHC: Unknown; Termination: SMD/SMT; Halogen Free: Halogen Free; Thickness: 558.8µm; Case/Package: 0402
C55 = CMP-06035-014734-1: Chip Multilayer Ceramic Capacitors for General Purpose, 0201, 100pF, X5R, 15%, 10%, 25V; Voltage Rating (DC): 25V; Length: 600um; Width: 300um; Dielectric: X5R; Tolerance: 10%; Capacitance: 100pF; Thickness: 300um
C56 C57 = CMP-03020-030005-1: C0805 22 pF X7R 30ppm/°C 5.00% 50 V; Manufacturer: KEMET; Voltage Rating: 50 V; Value: 22 pF; Material: Ceramic; Tolerance: 0.05; RoHS: TRUE; Temperature Range Low: -55°C; Temperature: -55°C to +125°C; Device Class L3: Ceramic Capacitors; Temperature Coefficient: 30ppm/°C; Temperature Range High: +125°C; Octopart: https://octopart.com/c0805c220j5ractu-kemet-76790706; Automotive: No; Manufacturer Part Number: C0805C220J5RACTU; ComponentLink2Description: Datasheet; Ipc Land Pattern Name: CAPC200125X78; Temperature Characteristic: X7R; Category: Cap; Package: C0805C-DN; Lead Free: Yes; Capacitance: 22 pF; Device Class L2: Capacitors; ComponentLink2URL: https://content.kemet.com/datasheets/KEM_C1003_C0G_SMD.pdf; Height: 0.88mm; Device Class L1: Passive Components
C58 C59 = CMP-03422-001519-1: CAP CER 15PF 50V C0G/NPO 0402; Insulation Resistance: 100GR; Dielectric Material: Ceramic; Tolerance: 5%; Dielectric: C0G; Width: 0.02inch; Case Code (Imperial): 0402; Voltage Rating (DC): 50V; Case Code (Metric): 1005; REACH SVHC: No SVHC; Mount: Surface Mount; Min Operating Temperature: -55°C; Depth: 0.5mm; Voltage Rating: 50V; Voltage: 50V; Thickness: 0.022inch; Length: 1mm; Max Operating Temperature: 125°C; Lead Free: Lead Free; Capacitance: 15pF; Height: 0.5mm; Packaging: Tape and Reel; Radiation Hardening: No; Package Quantity: 1; Case/Package: 0402; Number of Pins: 2; RoHS Compliant: Yes; Resistor Type: Ceramic; Series: CC; Termination: SMD/SMT
C61 C66-C69 = CMP-2010-01567-2: Chip Multilayer Ceramic Capacitors for General Purpose, 0201, 56pF, C0G, 30ppm/°C, 5%, 50V; Width: 0.012inch; Termination: SMD/SMT; Voltage: 50V; Case Code (Imperial): 0201; Case/Package: 0201; Lead Free: Lead Free; Voltage Rating (DC): 50V; Height: 0.3mm; Min Operating Temperature: -55°C; Package Quantity: 15000; Mount: Surface Mount; Length: 0.6mm; Max Operating Temperature: 125°C; Depth: 0.3mm; Thickness: 0.013inch; Tolerance: 5%; Packaging: Tape and Reel; Capacitance: 56pF; Voltage Rating: 50V; Dielectric: C0G; Case Code (Metric): 0603
C62 = CMP-2010-01269-2: Chip Multilayer Ceramic Capacitors for General Purpose, 0201, 10000pF, X5R, 15%, 10%, 25V; Capacitance: 10nF; Weight: 1.2E-05oz; Tolerance: 10%; Length: 0.6mm; Case Code (Metric): 0603; Min Operating Temperature: -55°C; Lead Free: Lead Free; Mount: Surface Mount; Voltage: 25V; REACH SVHC: No SVHC; Dielectric: X5R; Case Code (Imperial): 0201; Depth: 0.3mm; Packaging: Tape and Reel; Package Quantity: 15000; Case/Package: 0201; Voltage Rating (DC): 25V; Height: 0.3mm; Max Operating Temperature: 85°C; Termination: SMD/SMT; Voltage Rating: 25V; Width: 0.3mm; Thickness: 0.013inch
C63 C64 = CMP-2008-03697-2: Ceramic Capacitor for Automotive 120pF ±5% 50VDC C0G 0402 Paper T/R; Voltage Rating: 50V; Dielectric: C0G; Min Operating Temperature: -55°C; Case/Package: 0402; Radiation Hardening: No; Thickness: 0.022inch; Packaging: Tape and Reel; Case Code (Imperial): 0402; Capacitance: 120pF; Package Quantity: 10000; Ratings: AEC-Q200; Mount: Surface Mount; Case Code (Metric): 1005; Max Operating Temperature: 125°C; Tolerance: 5%; Voltage Rating (DC): 50V; Width: 0.02inch; Termination: SMD/SMT; Length: 1mm; Depth: 0.5mm; Height: 0.5mm
C65 = CMP-2008-03722-1: Manufacturer: Murata; Part Number: GCM155R71H102KA37D
C70 C75 = CMP-2008-03760-2: Multi-Layer Ceramic Capacitor 1pF C0G  ±0.05pF 0402 Paper T/R; Voltage Rating (DC): 50V; Length: 1mm; Height: 0.5mm; Thickness: 0.022inch; Dielectric: C0G; Capacitance: 1pF; Case/Package: 0402; Packaging: Tape and Reel; Mount: Surface Mount; Case Code (Imperial): 0402; Case Code (Metric): 1005; Radiation Hardening: No; Min Operating Temperature: -55°C; Voltage: 50V; Voltage Rating: 50V; Lead Free: Lead Free; Depth: 0.5mm; Max Operating Temperature: 125°C; Width: 0.5mm; Package Quantity: 10000; Termination: SMD/SMT
C71 = CMP-2010-00745-2: Ceramic Capacitor 1.2pF ±0.1pF 25V C0G 0201 (0603 Metric); Voltage Rating (DC): 25V; Mount: Surface Mount; Case/Package: 0201; Package Quantity: 15000; Max Operating Temperature: 125°C; Packaging: Tape and Reel; Radiation Hardening: No; Min Operating Temperature: -55°C; Case Code (Metric): 0603; Termination: SMD/SMT; Case Code (Imperial): 0201; Voltage Rating: 25V; Thickness: 0.013inch; Length: 0.6mm; Height: 0.3mm; Capacitance: 1.2pF; Depth: 0.3mm; Series: GJM; Dielectric: C0G; Construction: Flat; Width: 0.012inch
C73 C74 = CMP-2000-06090-1: Chip Capacitor, 4.7 uF, +/- 10%, 6.3 V, -55 to 85 degC, 0603 (1608 Metric), RoHS, Tape and Reel; Manufacturer: Samsung Electro-Mechanics; Dielectric: X5R; Capacitance: 4700000pF; Rated Voltage: 6.3V; Manufacturer URL: http://www.samsungsem.com/global/index.jsp; Case Size/Dimension: 0603; Package Description: 2-Pin Surface Mount Device, Body 1.60 x 0.80 mm; Datasheet Version: 07/2016; Datasheet URL: http://www.samsungsem.com/kr/support/product-search/mlcc/__icsFiles/afieldfile/2016/08/18/S_CL10A475KQ8NNNC.pdf; Tolerance (%): ±10%; Mounting Technology: SurfaceMount; Package Reference: 0603
D4 = CMP-03913-90235585-1: 150505M173300 WL-SFTW SMT full-color TOP LED waterclear; Max Reverse Voltage (DC): 5V; Forward Current: 80mA; Max Junction Temperature (Tj): 115°C; Peak Wavelength: 465nm; Color: Blue, Green, Red; Viewing Angle: 120°; Luminous Intensity: 350mcd; Dominant Wavelength: 520nm; Forward Voltage: 2V; Power Dissipation: 72mW; Length: 5.4mm; Width: 5mm; Min Operating Temperature: -40°C; Height: 1.5mm; Packaging: Tape and Reel; Max Operating Temperature: 85°C; RoHS: Compliant; Reverse Voltage: 5V; NexarPartId: 90235585
J4 J5 = CMP-03357-000011-1: UMCC MICRO-COAX RECEPTACLE, GEN
J7 J8 = CMP-2000-05888-3: CONN HEADER VERT 2POS 2.5MM; Current Rating: 3A; Voltage Rating: 250V; Number of Contacts: 2; Contact Resistance: 20mR; Wire/Cable Gauge: 22AWG; Insulation Resistance: 1GR; Connector Type: Male Pin; Packaging: Bulk; Contact Material: Brass; Lead Free: Lead Free; Orientation: Straight; Contact Plating: Tin; Max Current Rating: 3A; Termination: Solder; Fastening Type: Detent; Depth: 5.75mm; Housing Material: Polyamide; REACH SVHC: No SVHC; Series: XH; Voltage Rating (AC): 250V; Number of Positions: 2; Color: Natural; Contact Type: Male Pin; Max Voltage Rating (DC): 250V; Pitch: 2.5mm; Lead Pitch: 2.5mm; Mount: Through Hole; Max Operating Temperature: 85°C; Length: 7.4mm; Max Voltage Rating (AC): 250V; Min Operating Temperature: -25°C; Number of Rows: 1; Housing Color: White
L3 = CMP-14484-001248-1: SMD Inductors 10uH ±10% 0.12A 0.91Ω 0805; Current Rating: 120mA; DC Resistance (DCR): 700mR; Self Resonant Frequency: 32MHz; Core Material: Ferrite; Shielding: Unshielded; Test Frequency: 2.52MHz; RoHS Compliant: Yes; Case Code (Imperial): 0805; Termination: SMD/SMT; Lead Pitch: 1mm; Inductance: 10uH; Height - Seated (Max): 0.057inch; Max DC Current: 120mA; Packaging: Tape and Reel; Width: 0.049inch; Case/Package: 0805; Max Operating Temperature: 105°C; Series: LB; Number of Pins: 2; Lead Free: Lead Free; Height: 1.25mm; Tolerance: 10%; Case Code (Metric): 2012; Mount: Surface Mount; REACH SVHC: No SVHC; Min Operating Temperature: -40°C; Inductance Tolerance: 10%; Package Quantity: 3000; Resistor Type: Wirewound; Length: 0.079inch; Weight: 0.000194oz; Halogen Free: Halogen Free
L4 = CMP-14484-000136-1: SMD Inductors 15uH ±10% 0.65A 0.416Ω 1007; Self Resonant Frequency: 23MHz; Shielding: Unshielded; Max DC Current: 650mA; DC Resistance (DCR): 416mR; Test Frequency: 2.52MHz; Saturation Current: 180mA; Core Material: Ferrite; Length: 0.098inch; Case Code (Imperial): 1007; Case Code (Metric): 2518; Radiation Hardening: No; Width: 1.8mm; Inductance: 15uH; Termination: SMD/SMT; Case/Package: 1007; Mount: Surface Mount; Tolerance: 10%; Height: 1.8mm; Resistor Type: Wirewound; Max Operating Temperature: 105°C; Depth: 2mm; Current Rating: 650mA; Series: CB; Min Operating Temperature: -40°C; Package Quantity: 2000; Height - Seated (Max): 0.079inch; Packaging: Cut Tape; Inductance Tolerance: 10%; Halogen Free: Halogen Free
L5 = CMP-2000-06578-2: Multilayer type RF Inductor 27nH ±5% 0.46Ω 350mA 0402; DC Current: 300mA; Core Material: Air; Self Resonant Frequency: 1.7GHz; Q Factor: 8; DC Resistance (DCR): 460mR; Shielding: Unshielded; Test Frequency: 100MHz; Inductance: 27nH; Width: 0.02inch; Length: 1mm; Height - Seated (Max): 0.022inch; Military Standard: Not; Case Code (Imperial): 0402; Tolerance: 5%; Depth: 0.55mm; Current Rating: 300mA; Inductance Tolerance: 5%; Lead Free: Lead Free; Height: 0.5mm; Max DC Current: 300mA; REACH SVHC: No SVHC; Package Quantity: 10000; Mount: Surface Mount; Termination: SMD/SMT; Case Code (Metric): 1005; Case/Package: 0402; Max Operating Temperature: 125°C; Packaging: Tape and Reel; Min Operating Temperature: -55°C
L6 = CMP-06042-008654-1: Wire Wound RF Inductor 5.6nH ±2% 1770mA 0.04Ω 0402 (1005); Core Material: Air; Current Rating: 1.77A; DC Resistance (DCR): 40mR; Test Frequency: 100MHz; Shielding: Unshielded; Self Resonant Frequency: 8GHz; Max Operating Temperature: 125°C; Inductance: 5.6nH; Tolerance: 2%; Resistor Type: Wirewound; Min Operating Temperature: -55°C; Case/Package: 0402; Packaging: Tape and Reel; Mount: Surface Mount
L7 = CMP-06042-002373-1: Multilayer type RF Inductor 4.7nH ±0.3nH 0.16Ω 700mA 0402; Shielding: Unshielded; Q Factor: 8; Max DC Current: 300mA; DC Resistance (DCR): 180mR; Test Frequency: 100MHz; Core Material: Air; Self Resonant Frequency: 6GHz; Package Quantity: 10000; Case Code (Metric): 1005; Mount: Surface Mount; Packaging: Tape and Reel; Height - Seated (Max): 0.022inch; Military Standard: Not; Lead Free: Lead Free; Max Operating Temperature: 125°C; Radiation Hardening: No; Case/Package: 0402; Inductance: 4.7nH; DC Current: 300mA; Depth: 0.55mm; Case Code (Imperial): 0402; Width: 0.5mm; Length: 1mm; Termination: SMD/SMT; Height: 0.5mm; Current Rating: 300mA; Min Operating Temperature: -55°C
L8 = CMP-03913-120013758-1: 7447840022G Multilayer Inductor, 2.2Nh, 0.3A, 0402 Rohs Compliant: Yes; Current Rating: 300mA; Height: 500µm; Ambient Temperature Range Low: -55°C; Length: 1mm; RoHS: Compliant; NexarPartId: 120013758; Max Operating Temperature: 125°C; Width: 500µm; Min Operating Temperature: -55°C; Inductance: 2.2nH; Ambient Temperature Range High: 105°C
R53-R55 R57 = CMP-26527-000153-1: 10kΩ ±5% 0.1W 0603 Thick Film Chip Resistor AEC-Q200 compliant; Temperature Coefficient: 200ppm/°C; Resistance: 10kR; Max Power Dissipation: 100mW; Tolerance: 5%; Case Code (Imperial): 0603; Series: RMCF; Resistor Type: Thick Film; Length: 0.061inch; Features: Automotive AEC-Q200; Height: 0.022inch; Case Code (Metric): 1608; Width: 0.031inch; Number of Terminations: 2; Contact Plating: Tin; Case/Package: 0603; Package Quantity: 1; Max Operating Temperature: 155°C; Mount: Surface Mount; RoHS Compliant: Yes; Radiation Hardening: No; Min Operating Temperature: -55°C; Packaging: Tape and Reel
R56 = CMP-03412-048508-1: Anti-Sulfurated Chip Resistors Automotive Grade 33kΩ 1% 100ppm/°C 0402; Resistance: 33kR; Max Power Dissipation: 63mW; Number of Terminations: 2; Series: AF; Max Operating Temperature: 155°C; Case/Package: 0402; Width: 0.02inch; RoHS Compliant: Yes; Tolerance: 1%; Length: 0.039inch; Packaging: Tape and Reel; Height: 0.015inch; Resistor Type: Thick Film; Min Operating Temperature: -55°C; Features: Moisture Resistant; Temperature Coefficient: 100ppm/°C
R94 = CMP-2000-00245-1: Manufacturer: Panasonic; Part Number: ERJ-3EKF1400V
R95 R96 = CMP-2002-08072-1: Manufacturer: Yageo; Part Number: RC0402JR-1320RL
SW5 = CMP-1459-00004-3: Switch Tactile Spst-no 0.05A 12V; Operating Force: 1.56N; Contact Resistance: 100mΩ; Switch Function: Off-Mom; Mechanical Life: 50kcycles; Switch Travel: 250µm; Actuator Material: Liquid Crystal Polymer, Polymer; Current Rating: 50mA; Throw Configuration: SPST; Actuator Length: 800µm; Illumination Type: Illuminated, Non-Illuminated; Color: Black; Height: 2.5mm; Contact Material: Stainless Steel, Steel; Voltage Rating: 12V; Packaging: Tape and Reel; Contact Plating: Silver; Max Operating Temperature: 85°C; RoHS: Compliant; Lead Free: Lead Free; Termination: SMD/SMT; REACH SVHC: No SVHC; Mount: Surface Mount; Min Operating Temperature: -40°C; Length: 7.3mm; Insulation Resistance: 100MΩ; Contact Current Rating: 50mA
U12 = NRF52840-QFAA-R7: No Description Available; Manufacturer_Name: Nordic Semiconductor; Copyright: Copyright (C) 2025 Ultra Librarian. All rights reserved.; Manufacturer_Part_Number: NRF52840-QFAA-R7; RefDes: RefDes; Type: Type
U13 = NRF21540-QDAA-R: No Description Available; Manufacturer_Name: Nordic Semiconductor; Copyright: Copyright (C) 2025 Ultra Librarian. All rights reserved.; Manufacturer_Part_Number: NRF21540-QDAA-R; RefDes: RefDes; Type: Type
U14 = TESEO-LIV3R: Teseo ROM GNSS module; Manufacturer_Name: STMicroelectronics; Copyright: Copyright (C) 2025 Ultra Librarian. All rights reserved.; Manufacturer_Part_Number: TESEO-LIV3R; Datasheet: https://www.st.com/resource/en/datasheet/teseo-liv3r.pdf; RefDes: RefDes; Type: Type
U15 = CMP-32860-000003-1: IC AMP GPS 1.55-1.615GHZ TSLP6-2; Manufacturer: Infineon; Max Power Dissipation: 72mW; Noise Figure: 0.65dB; Gain: 20dB; Max Junction Temp: +150°C; Nominal Supply Current: 3.6mA; Max Supply Voltage: 3.6V; Min Supply Voltage: 1.5V; Max Frequency: 1615MHz; Bandwidth: 65MHz; RoHS: TRUE; Device Class L1: Integrated Circuits (ICs); Manufacturer Part Number: BGA725L6E6327FTSA1; Octopart: https://octopart.com/bga725l6e6327ftsa1-infineon-23421878; Temperature Range High: +150°C; Temperature: to +150°C; ComponentLink2URL: https://www.infineon.com/dgdl/Infineon-BGA725L6-DS-v02_00-en.pdf?fileId=db3a30433784a0400137ef9a4d341f23; Device Class L2: RF Semiconductors and Devices; Ambient Temperature Range Low: -40°C; Device Class L3: RF Amplifiers; ComponentLink2Description: Datasheet; Mouser Description: RF Amp Chip Single Low Noise Amplifier 1615MHz 3.6V 6-Pin TSLP T/R; Digikey Description: IC AMP GPS 1.55-1.615GHZ TSLP6-2; Package: PG-TSLP-6; Ambient Temperature Range High: +85°C; Footprint Url: https://www.infineon.com/cms/en/product/packages/PG-TSLP/PG-TSLP-6-2/; Category: IC; Lead Free: Yes; Height: 0.4mm; Automotive: No
U16 = B39162B4327P810: No Description Available; Manufacturer_Name: Qualcomm; Copyright: Copyright (C) 2025 Ultra Librarian. All rights reserved.; Manufacturer_Part_Number: B39162B4327P810; RefDes: RefDes; Type: Type
Y3 = CMP-0447-00001-4: Crystal 32.768kHz ±20ppm (Tol) 12.5pF FUND 70kΩ 2-Pin CSMD T/R; ESR (Equivalent Series Resistance): 70kR; Radiation Hardening: No; Frequency: 32.768kHz; Length: 3.2mm; Max Operating Temperature: 85°C; Number of Pins: 2; Series: ABS07; Min Operating Temperature: -40°C; Frequency Tolerance: 20ppm; Packaging: Tape and Reel; Height: 0.9mm; Width: 1.5mm; Depth: 1.5mm; Load Capacitance: 12.5pF; RoHS Compliant: Yes; Tolerance: 20ppm; Termination: SMD/SMT; Lead Free: Lead Free; Series Resistance: 70kR; REACH SVHC: No SVHC; Case/Package: CSMD; Operating Frequency: 32.768 kHz; Package Quantity: 3000
Y4 = CMP-27762-012264-1: Crystal 32MHz ±10ppm 10pF SMD-4 3.2mm x 2.5mm

## Nets that join several sheets
+1V8: SingleBoardDrone_Pow (*27.TP1 C38.1 U10.5), SingleBoardDrone_Sens (*28.TP1 A1.10 C40.1)
+3V3: SingleBoardDrone_Pow (8 pins), SingleBoardDrone_RP2350 (29 pins), SingleBoardDrone_Act (18 pins), SingleBoardDrone_Sens (SW4.1), SingleBoardDrone_RF (20 pins)
GND: SingleBoardDrone_Pow (29 pins), SingleBoardDrone_RP2350 (32 pins), SingleBoardDrone_Act (48 pins), SingleBoardDrone_Sens (21 pins), SingleBoardDrone_RF (56 pins)
V+ USB: SingleBoardDrone_Pow (5 pins), SingleBoardDrone_RP2350 (C18.2 J1.A4 J1.A9 R10.1)
V_Bus: SingleBoardDrone_Pow (6 pins), SingleBoardDrone_Act (12 pins)
Net*6_TP1: SingleBoardDrone_RP2350 (U1.12), SingleBoardDrone_Act (*6.TP1 U6.5)
Net*7_TP1: SingleBoardDrone_RP2350 (U1.16), SingleBoardDrone_Act (*7.TP1 U8.5)
Net*16_TP1: SingleBoardDrone_RP2350 (U1.27), SingleBoardDrone_Act (*16.TP1 U19.5)
Net*17_TP1: SingleBoardDrone_RP2350 (U1.18), SingleBoardDrone_Act (*17.TP1 U17.5)
NetA1_2: SingleBoardDrone_RP2350 (U1.9), SingleBoardDrone_Sens (A1.2)
NetA1_4: SingleBoardDrone_RP2350 (U1.10), SingleBoardDrone_Sens (A1.4)
NetA1_6: SingleBoardDrone_RP2350 (U1.8), SingleBoardDrone_Sens (A1.6)
NetA1_7: SingleBoardDrone_RP2350 (U1.7), SingleBoardDrone_Sens (A1.7)
NetJ3_4: SingleBoardDrone_RP2350 (U1.33), SingleBoardDrone_Sens (J3.4 R50.1 U11.19)
NetJ3_5: SingleBoardDrone_RP2350 (U1.32), SingleBoardDrone_Sens (J3.5 R49.2 U11.20)
NetJ3_7: SingleBoardDrone_RP2350 (U1.3), SingleBoardDrone_Sens (J3.7 U11.14)
NetQ2_1: SingleBoardDrone_RP2350 (U1.36), SingleBoardDrone_Act (Q2.1 Q3.1 Q4.1 Q5.1)
NetR6_1: SingleBoardDrone_RP2350 (R6.1 U1.2), SingleBoardDrone_Act (R99.2)
NetR97_1: SingleBoardDrone_Pow (R97.1), SingleBoardDrone_RP2350 (U1.42)
NetR98_1: SingleBoardDrone_Pow (R98.1), SingleBoardDrone_RF (U12.40)
NetU1_4: SingleBoardDrone_RP2350 (U1.4), SingleBoardDrone_Act (U21.11)
NetU1_5: SingleBoardDrone_RP2350 (U1.5), SingleBoardDrone_Act (U6.6)
NetU1_13: SingleBoardDrone_RP2350 (U1.13), SingleBoardDrone_Act (U8.6)
NetU1_14: SingleBoardDrone_RP2350 (U1.14), SingleBoardDrone_RF (U12.29)
NetU1_15: SingleBoardDrone_RP2350 (U1.15), SingleBoardDrone_RF (U12.30)
NetU1_17: SingleBoardDrone_RP2350 (U1.17), SingleBoardDrone_Act (U17.6)
NetU1_19: SingleBoardDrone_RP2350 (U1.19), SingleBoardDrone_Act (U19.6)
NetU1_34: SingleBoardDrone_RP2350 (U1.34), SingleBoardDrone_Act (U21.10)
NetU1_41: SingleBoardDrone_Pow (U3.3), SingleBoardDrone_RP2350 (U1.41)
NetU1_43: SingleBoardDrone_RP2350 (U1.43), SingleBoardDrone_Act (U21.3)
Therm_Bat: SingleBoardDrone_Pow (J2.2), SingleBoardDrone_RP2350 (U1.40)

## Assembly variants
SingleBoardDrone_v1: not fitted C54 R6